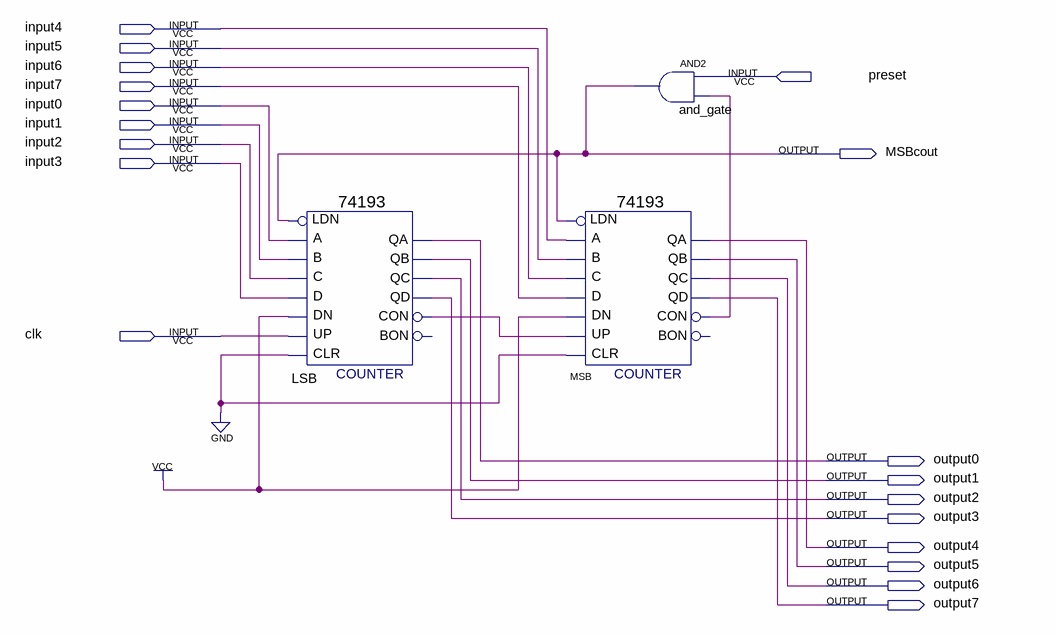
[diagram p0: schematic sheet]
// Quartus schematic div113.bdf as structural Verilog: 3 symbols, 19 pins
module div113 (
  input  input4,
  input  input5,
  input  input6,
  input  preset,
  input  input7,
  input  input0,
  input  input1,
  input  input2,
  input  input3,
  input  clk,
  output MSBcout,
  output output0,
  output output1,
  output output2,
  output output3,
  output output4,
  output output5,
  output output6,
  output output7
);

  wire LSB_con, MSB_con;

  \74193  LSB (
    .D(input3), .C(input2), .B(input1), .A(input0), .CLR(1'b0), .UP(clk), .DN(1'b1), .LDN(MSBcout),
    .QB(output1), .QA(output0), .CON(LSB_con), .QD(output3), .QC(output2));  // open: BON
  \74193  MSB (
    .D(input7), .C(input6), .B(input5), .A(input4), .CLR(1'b0), .UP(LSB_con), .DN(1'b1), .LDN(MSBcout),
    .QB(output5), .QA(output4), .CON(MSB_con), .QD(output7), .QC(output6));  // open: BON
  and and_gate (MSBcout, preset, MSB_con);
endmodule
